# EAGLE design IRSensorController (EAGLE 9.4.2)
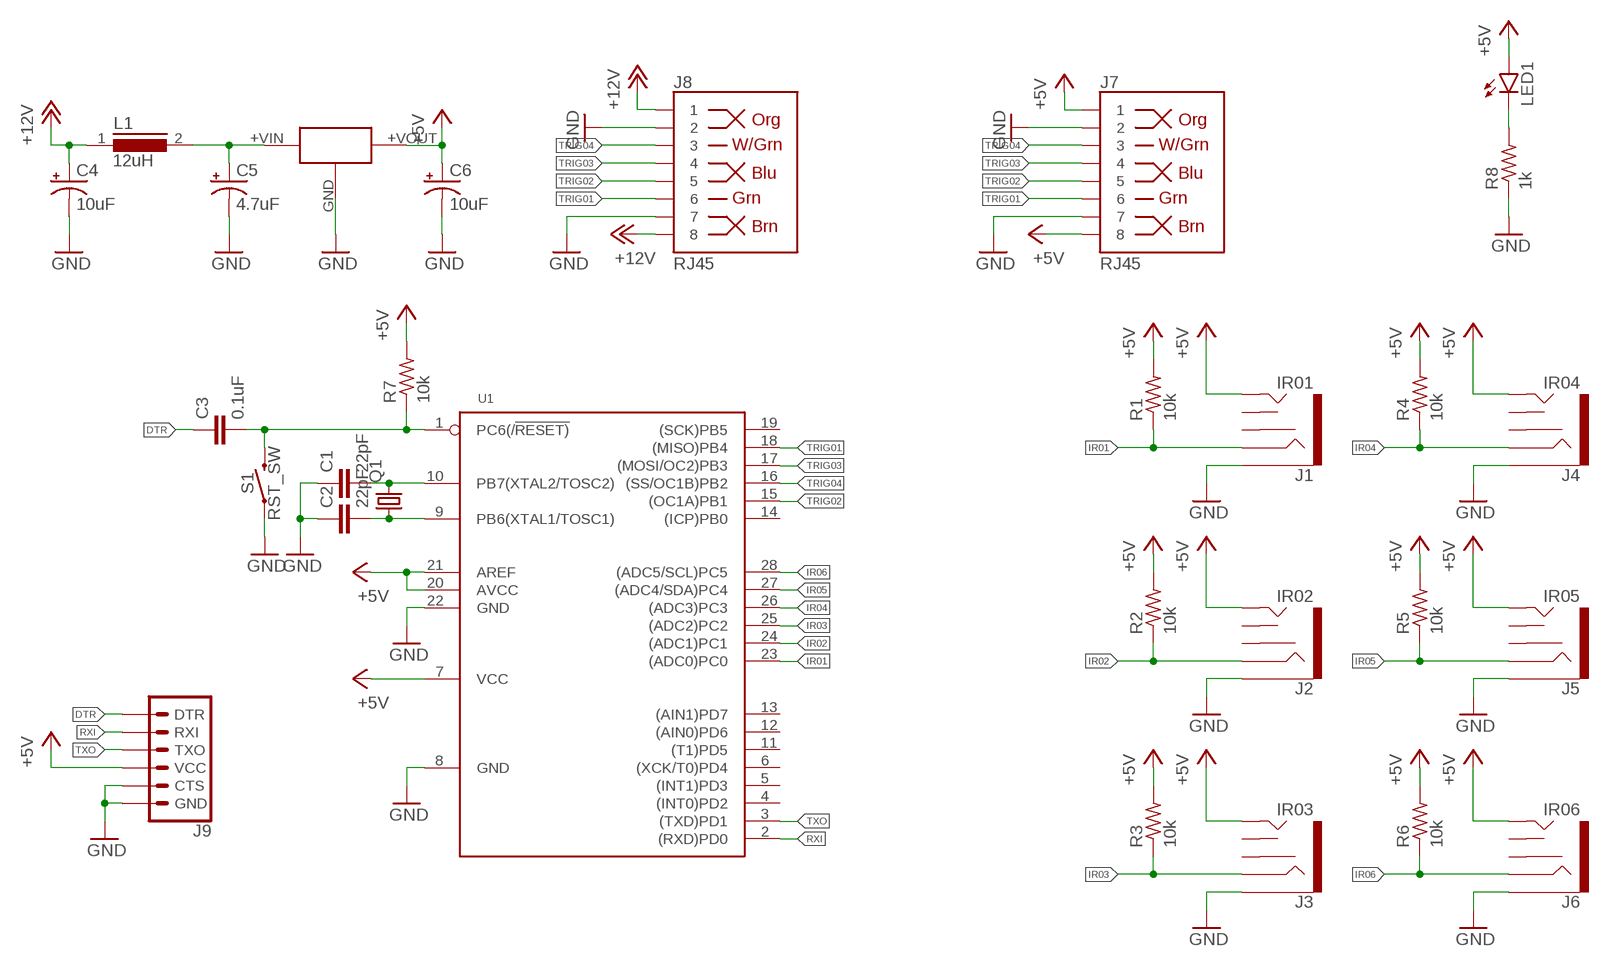
[diagram p0: schematic, sheet 1]

## Parts
C1  22pF  C-EU050-025X075  [C050-025X075]
C2  22pF  C-EU050-025X075  [C050-025X075]
C3  0.1uF  C-EU050-025X075  [C050-025X075]
C4  10uF  CPOL-USE3.5-8  [E3,5-8]
C5  4.7uF  CPOL-USE2.5-7  [E2,5-7]
C6  10uF  CPOL-USE3.5-8  [E3,5-8]
J1  IR01  AUDIO_JACK_3.5MM_KIT  [AUDIO-JACK-KIT]
J2  IR02  AUDIO_JACK_3.5MM_KIT  [AUDIO-JACK-KIT]
J3  IR03  AUDIO_JACK_3.5MM_KIT  [AUDIO-JACK-KIT]
J4  IR04  AUDIO_JACK_3.5MM_KIT  [AUDIO-JACK-KIT]
J5  IR05  AUDIO_JACK_3.5MM_KIT  [AUDIO-JACK-KIT]
J6  IR06  AUDIO_JACK_3.5MM_KIT  [AUDIO-JACK-KIT]
J7  RJ45  RJ45-8  [RJ45-8]
J8  RJ45  RJ45-8  [RJ45-8]
J9  6_PIN_SERIAL_TARGETSILK  [6_PIN_SERIAL_TARGET_SIDE_W_SILK]
L1  12uH  B82131  [SUKW1-17]
LED1  LED5MM  [LED5MM]
Q1  CRYSTALHC49S  [HC49/S]
R1  10k  R-US_0204/7  [0204/7]
R2  10k  R-US_0204/7  [0204/7]
R3  10k  R-US_0204/7  [0204/7]
R4  10k  R-US_0204/7  [0204/7]
R5  10k  R-US_0204/7  [0204/7]
R6  10k  R-US_0204/7  [0204/7]
R7  10k  R-US_0204/7  [0204/7]
R8  1k  R-US_0204/7  [0204/7]
S1  RST_SW  MOMENTARY-SWITCH-SPST-PTH-6.0MM  [TACTILE_SWITCH_PTH_6.0MM]
U1  MCU-ATMEGA328P-PU(DIP28)  [DIP28-2.54-34.7X7.62MM]
U$1  R_78E_5V  [R_78E]

## Nets
+5V: C6.+ J1.TIP J2.TIP J3.TIP J4.TIP J5.TIP J6.TIP J7.1 J7.8 J9.P$4(VCC) LED1.A R1.2 R2.2 R3.2 R4.2 R5.2 R6.2 R7.2 U1.7(VCC) U1.20(AVCC) U1.21(AREF) U$1.+VOUT
+12V: C4.+ J8.1 J8.8 L1.1
DTR: C3.1 J9.P$1(DTR)
GND: C1.1 C2.1 C4.- C5.- C6.- J1.SLEEVE J2.SLEEVE J3.SLEEVE J4.SLEEVE J5.SLEEVE J6.SLEEVE J7.2 J7.7 J8.2 J8.7 J9.P$5(CTS) J9.P$6(GND) R8.1 S1.1 U1.8(GND) U1.22(GND) U$1.GND
IR01: J1.RING R1.1 U1.23((ADC0)PC0)
IR02: J2.RING R2.1 U1.24((ADC1)PC1)
IR03: J3.RING R3.1 U1.25((ADC2)PC2)
IR04: J4.RING R4.1 U1.26((ADC3)PC3)
IR05: J5.RING R5.1 U1.27((ADC4/SDA)PC4)
IR06: J6.RING R6.1 U1.28((ADC5/SCL)PC5)
N$1: C5.+ L1.2 U$1.+VIN
N$2: LED1.K(C) R8.2
N$3: C2.2 Q1.1 U1.9(PB6(XTAL1/TOSC1))
N$4: C1.2 Q1.2 U1.10(PB7(XTAL2/TOSC2))
N$5: C3.2 R7.1 S1.3 U1.1(PC6(/!RESET))
RXI: J9.P$3(RXI) U1.2((RXD)PD0)
TRIG01: J7.6 J8.6 U1.18((MISO)PB4)
TRIG02: J7.5 J8.5 U1.15((OC1A)PB1)
TRIG03: J7.4 J8.4 U1.17((MOSI/OC2)PB3)
TRIG04: J7.3 J8.3 U1.16((SS/OC1B)PB2)
TXO: J9.P$2(TXO) U1.3((TXD)PD1)
Unconnected: J1.RSH J1.TSH J2.RSH J2.TSH J3.RSH J3.TSH J4.RSH J4.TSH J5.RSH J5.TSH J6.RSH J6.TSH U1.4((INT0)PD2) U1.5((INT1)PD3) U1.6((XCK/T0)PD4) U1.11((T1)PD5) U1.12((AIN0)PD6) U1.13((AIN1)PD7) U1.14((ICP)PB0) U1.19((SCK)PB5)

## Library data of the parts
C1-C3 = rcl:C-EU: CAPACITOR, European symbol; SPICEPREFIX: C
C4-C6 = rcl:CPOL-US: POLARIZED CAPACITOR, American symbol; SPICEPREFIX: C
J1-J6 = SparkFun-Connectors:AUDIO_JACK_3.5MM: Audio Jack 3.5mm variants of PTH and SMT stereo audio jack with bypass switches. SparkFun Products: SparkFun SparkPunk Sound Kit <[https://www.sparkfun.com/products/11177]> - PTH MP3 Trigger <https://www.sparkfun.com/products/13720> -3.5mm SMD SparkFun PicoBoard <https://www.sparkfun.com/products/11888>- 2.5mm SMD; PROD_ID: CONN-08774; SF_ID: PRT-08032
J7 J8 = SparkFun-Connectors:RJ45-8: RJ45 Jack - 8 pin Simple RJ45, 8-pin connection. Commonly used for Cat5, Cat5e, and Cat6 Ethernet cables. Here is the connector we sell at SparkFun: RJ45 8-Pin Connector <https://www.sparkfun.com/products/643> (PRT-00643) Datasheet <https://cdn.sparkfun.com/datasheets/Prototyping/04908.pdf> It is used on this SparkFun product: SparkFun RJ45 Breakout <https://www.sparkfun.com/products/716> (BOB-00716) Note, you may also be interested in the "MAGJACK" version of this. It is basically a RJ45 connector, but also has some status LEDs built into the connector housing. You can check that out in this library at the device named "MAGJACK.dev" and see these products online: RJ45 Ethernet MagJack-Compatible <https://www.sparkfun.com/products/8534> (PRT-08534) SparkFun RJ45 MagJack Breakout <https://www.sparkfun.com/products/13021> (BOB-13021); PROD_ID: CONN-08506; SF_ID: PRT-00643
J9 = SparkFun-Connectors:6_PIN_SERIAL_TARGET: 6-pin header connection for use with the "FTDI BASIC" pinout - TARGET SIDE. Also known as "Arduino Serial Program Header". It is used to mate with our FTDI Basic serial programmers using the Arduino IDE. Note, this device has "TARGET" in the name. It is intended to be used on a design that contains a target micro-controller that you wish to program. The "sister" device, named "CABLE" is inteneded to be used on a design that usually lives on the end of your USB cable and prvides the converter chip (FTDI232 or FTDI231x) to commnicate serial RX/TX. You can populate with some of these: Break Away Headers - Straight <https://www.sparkfun.com/products/116> (PRT-00116) For reference (or to suit your programming needs) check out these designs: SparkFun FTDI Basic Breakout - 5V <https://www.sparkfun.com/products/9716> (DEV-09716) SparkFun FTDI Basic Breakout - 3.3V <https://www.sparkfun.com/products/9873> (DEV-09873) SparkFun FTDI SmartBasic <https://www.sparkfun.com/products/12935> (DEV-12935) SparkFun Beefy 3 - FTDI Basic Breakout <https://www.sparkfun.com/products/13746> (DEV-13746)
L1 = inductors:B82131: INDUCTOR; SPICEPREFIX: L
LED1 = led:LED: LED OSRAM: - CHIPLED LG R971, LG N971, LY N971, LG Q971, LY Q971, LO R971, LY R971 LH N974, LH R974 LS Q976, LO Q976, LY Q976 LO Q996 - Hyper CHIPLED LW Q18S LB Q993, LB Q99A, LB R99A - SideLED LS A670, LO A670, LY A670, LG A670, LP A670 LB A673, LV A673, LT A673, LW A673 LH A674 LY A675 LS A676, LA A676, LO A676, LY A676, LW A676 LS A679, LY A679, LG A679 - Hyper Micro SIDELED® LS Y876, LA Y876, LO Y876, LY Y876 LT Y87S - SmartLED LW L88C, LW L88S LB L89C, LB L89S, LG L890 LS L89K, LO L89K, LY L89K LS L896, LA L896, LO L896, LY L896 - TOPLED LS T670, LO T670, LY T670, LG T670, LP T670 LSG T670, LSP T670, LSY T670, LOP T670, LYG T670 LG T671, LOG T671, LSG T671 LB T673, LV T673, LT T673, LW T673 LH T674 LS T676, LA T676, LO T676, LY T676, LB T676, LH T676, LSB T676, LW T676 LB T67C, LV T67C, LT T67C, LS T67K, LO T67K, LY T67K, LW E67C LS E67B, LA E67B, LO E67B, LY E67B, LB E67C, LV E67C, LT E67C LW T67C LS T679, LY T679, LG T679 LS T770, LO T770, LY T770, LG T770, LP T770 LB T773, LV T773, LT T773, LW T773 LH T774 LS E675, LA E675, LY E675, LS T675 LS T776, LA T776, LO T776, LY T776, LB T776 LHGB T686 LT T68C, LB T68C - Hyper Mini TOPLED® LB M676 - Mini TOPLED Santana® LG M470 LS M47K, LO M47K, LY M47K Source: http://www.osram.convergy.de LUXEON: - LUMILED® LXK2-PW12-R00, LXK2-PW12-S00, LXK2-PW14-U00, LXK2-PW14-V00 LXK2-PM12-R00, LXK2-PM12-S00, LXK2-PM14-U00 LXK2-PE12-Q00, LXK2-PE12-R00, LXK2-PE12-S00, LXK2-PE14-T00, LXK2-PE14-U00 LXK2-PB12-K00, LXK2-PB12-L00, LXK2-PB12-M00, LXK2-PB14-N00, LXK2-PB14-P00, LXK2-PB14-Q00 LXK2-PR12-L00, LXK2-PR12-M00, LXK2-PR14-Q00, LXK2-PR14-R00 LXK2-PD12-Q00, LXK2-PD12-R00, LXK2-PD12-S00 LXK2-PH12-R00, LXK2-PH12-S00 LXK2-PL12-P00, LXK2-PL12-Q00, LXK2-PL12-R00 Source: www.luxeon.com KINGBRIGHT: KA-3528ASYC Source: www.kingbright.com
Q1 = adafruit:CRYSTAL: CRYSTAL; OC_FARNELL: 1667008; OC_NEWARK: unknown
R1-R8 = rcl:R-US_: RESISTOR, American symbol; SPICEPREFIX: R
S1 = SparkFun-Switches:MOMENTARY-SWITCH-SPST: Momentary Switch (Pushbutton) - SPST Normally-open (NO) SPST momentary switches (buttons, pushbuttons). Variants PTH-12MM - 12mm square, through-hole Momentary Pushbutton Switch - 12mm Square <https://www.sparkfun.com/products/9190> (COM-09190) PTH-6.0MM, PTH-6.0MM-KIT - 6.0mm square, through-hole Mini Pushbutton Switch <https://www.sparkfun.com/products/97> (COM-00097) KIT package intended for soldering kit's - only one side of pads' copper is exposed. PTH-RIGHT-ANGLE-KIT - Right-angle, through-hole Right Angle Tactile Button <https://www.sparkfun.com/products/10791> - Used on SparkFun BigTime Watch Kit <https://www.sparkfun.com/products/11734> SMD-12MM - 12mm square, surface-mount Tactile Button - SMD (12mm) <https://www.sparkfun.com/products/12993> (COM-12993) Used on SparkFun PicoBoard <https://www.sparkfun.com/products/11888> SMD-4.5MM - 4.5mm Square Trackball Switch Used on SparkFun Blackberry Trackballer Breakout <https://www.sparkfun.com/products/13169> SMD-4.6MMX2.8MM - 4.60mm x 2.80mm, surface mount Used on SparkFun SAMD21 Mini Breakout <https://www.sparkfun.com/products/13664> SMD-5.2MM, SMD-5.2-REDUNDANT - 5.2mm square, surface-mount Mini Pushbutton Switch - SMD <https://www.sparkfun.com/products/8720> (COM-08720) Used on Arduino Pro Mini <https://www.sparkfun.com/products/11114> REDUNDANT package connects both switch circuits together SMD-6.0X3.5MM - 6.0 x 3.5mm, surface mount Momentary Reset Switch SMD <https://www.sparkfun.com/products/8229> (COM-08229) SMD-6.2MM-TALL - 6.2mm square, surface mount Tactile Button - SMD (6mm) <https://www.sparkfun.com/products/12992> Used on SparkFun Digital Sandbox <https://www.sparkfun.com/products/12651> SMD-RIGHT-ANGLE - Right-angle, surface mount Used on SparkFun Block for Intel® Edison - Arduino <https://www.sparkfun.com/products/13036>; PROD_ID: SWCH-08441; SF_SKU: COM-00097
U1 = Seeed-IC:MCU-ATMEGA328P-PU(DIP28): 310010051; MPN: ATMEGA328P-PU
U$1 = EzerLonginus:R_78E_5V

## Board
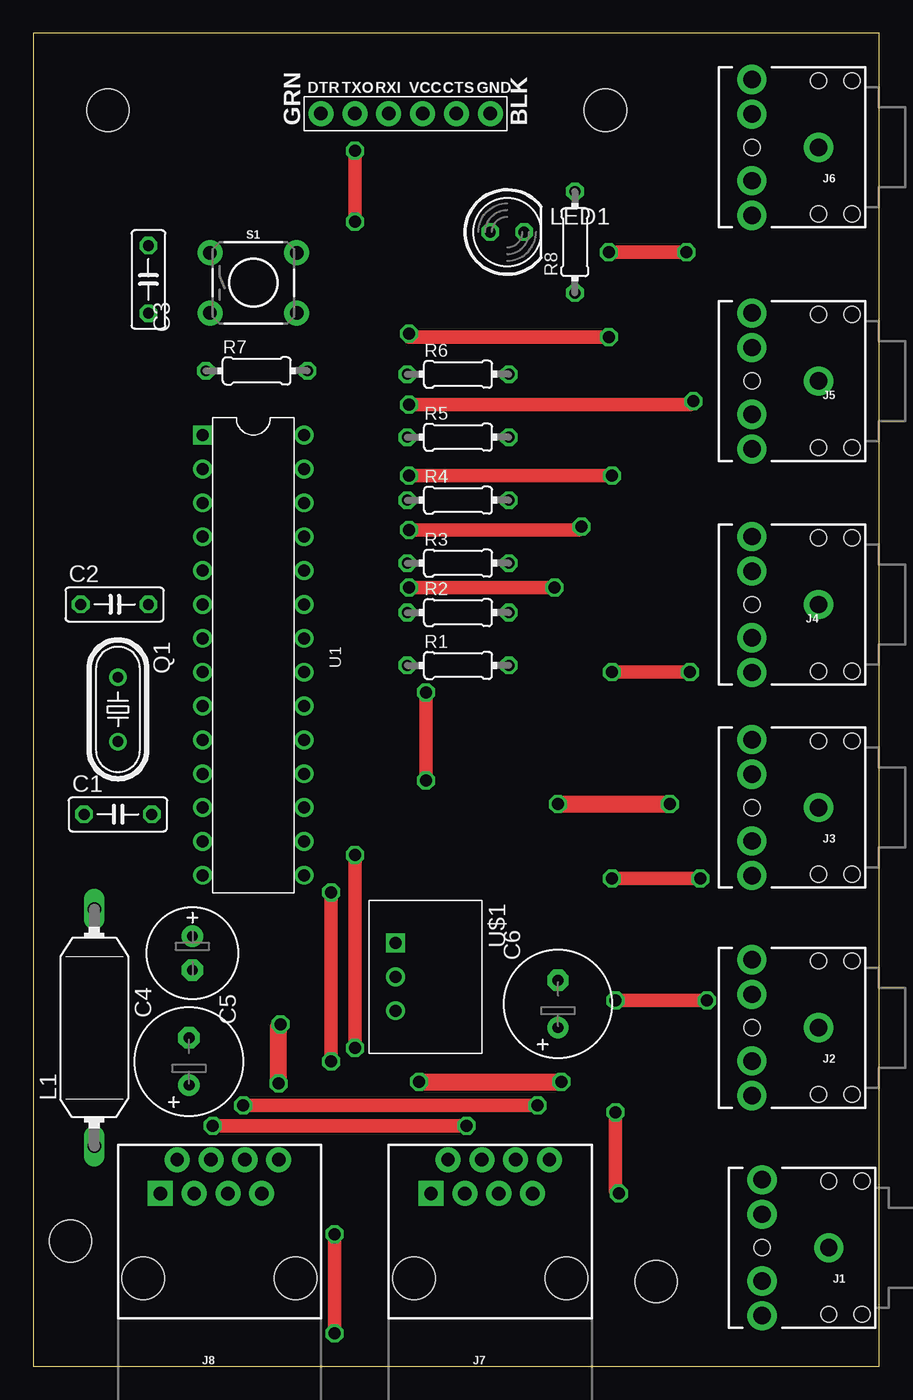
[diagram p1: board, top side]
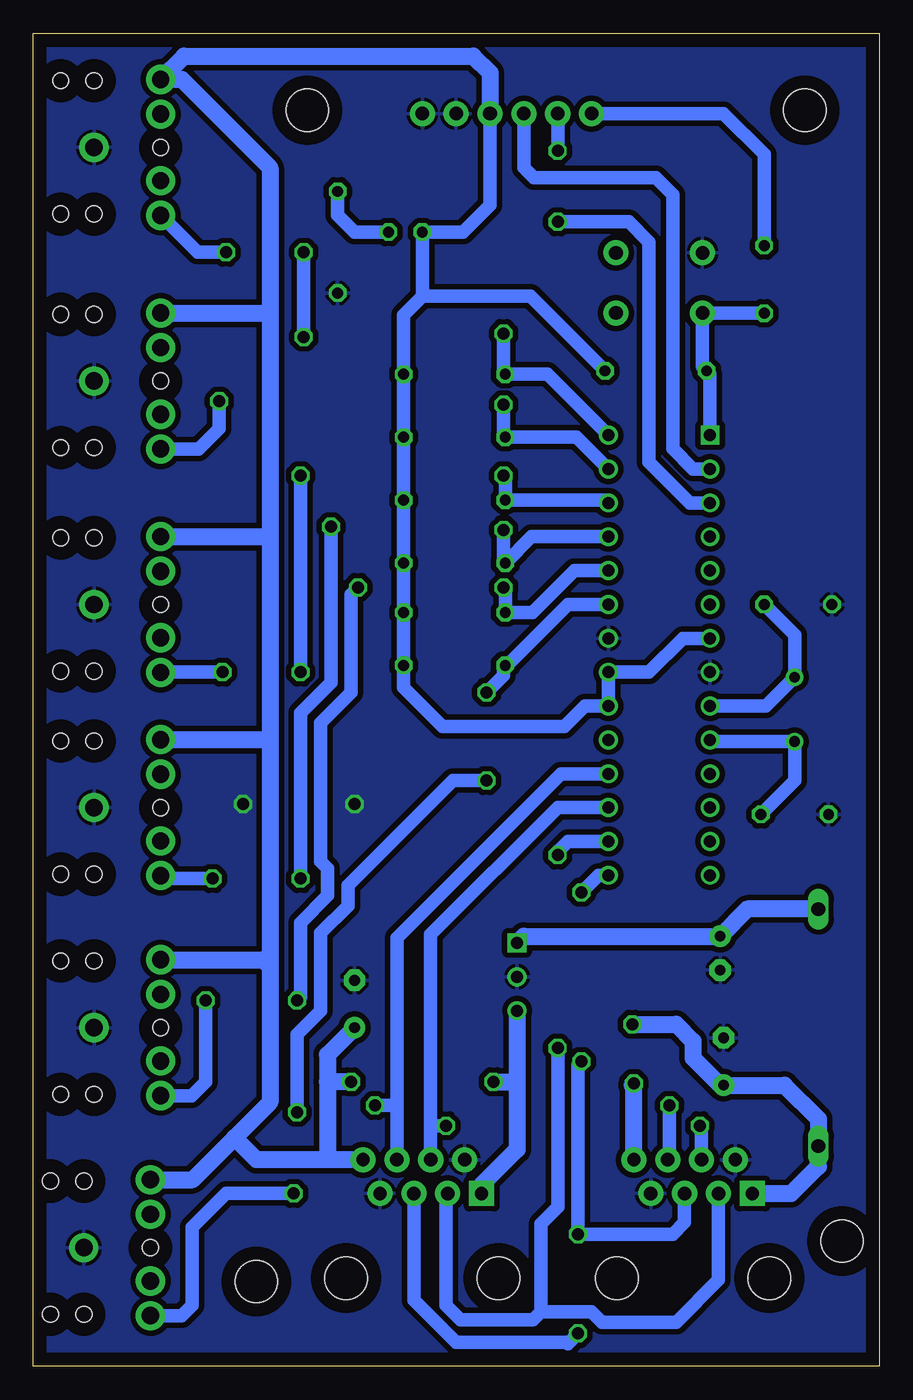
[diagram p2: board, bottom side, seen from below]

Size 63.48 x 100 mm. Coordinates in mm from the lower left corner, seen from the top.
Outline: 0,0 63.48,0 63.48,100 0,100 0,0
Copper layers (1*16): Top 0.035mm / dielectric 1.5mm / Bottom 0.035mm
Design rules "default": minimum track width 6mil, minimum drill 0.35mm, track to track 6mil, track to pad 6mil, pad to pad 6mil, via to via 6mil, smd to smd 6mil, copper to edge 40mil, drill to drill 6mil, minimum pad ring 10mil, minimum via ring 8mil, stop-mask expansion 4mil, vias tented up to drill 0mil, thermal gap 10mil
Holes 3.17 mm at 5.59,94.23 42.93,94.23 46.74,6.35 2.79,9.4

### Footprints (pad centres in the part's own frame; a part is rotated, then mirrored left to right if it is on the bottom)
C050-025X075 = drill 0.813 octagon: 1 -2.54,0; 2 2.54,0
E3,5-8 = drill 0.813 pad 1.6: + -1.778,0 | drill 0.813 pad 1.6 octagon: - 1.778,0
E2,5-7 = drill 0.813 pad 1.6: + -1.27,0 | drill 0.813 pad 1.6 octagon: - 1.27,0
AUDIO-JACK-KIT = drill 1.3 pad 2.184: RING 5,5.1; RSH 5,2.5; SLEEVE 0,0; TIP 5,-5.1; TSH 5,-2.5 | hole 1.2: 0,5; -2.5,5; -2.5,-5; 0,-5; 5,0
RJ45-8 = drill 1 pad 1.88 square: 1 -4.445,6.35 | drill 1 pad 1.88: 2 -3.175,8.89; 3 -1.905,6.35; 4 -0.635,8.89; 5 0.635,6.35; 6 1.905,8.89; 7 3.175,6.35; 8 4.445,8.89 | hole 3.2: -5.715,0; 5.715,0
6_PIN_SERIAL_TARGET_SIDE_W_SILK = drill 1.016 pad 1.88: P$1 -6.35,0; P$2 -3.81,0; P$3 -1.27,0; P$4 1.27,0; P$5 3.81,0; P$6 6.35,0
SUKW1-17 = drill 1.016 long: 1 -8.89,0; 2 8.89,0
LED5MM = drill 0.813 octagon: A -1.27,0; K 1.27,0
HC49/S = drill 0.813: 1 -2.413,0; 2 2.413,0
0204/7 = drill 0.813 octagon: 1 -3.81,0; 2 3.81,0
TACTILE_SWITCH_PTH_6.0MM = drill 1.016 pad 1.88: 1 -3.251,2.261; 2 3.251,2.261; 3 -3.251,-2.261; 4 3.251,-2.261
DIP28-2.54-34.7X7.62MM = drill 0.9 pad 1.4 square: 1 -16.51,-3.81 | drill 0.9 pad 1.4: 2 -13.97,-3.81; 3 -11.43,-3.81; 4 -8.89,-3.81; 5 -6.35,-3.81; 6 -3.81,-3.81; 7 -1.27,-3.81; 8 1.27,-3.81; 9 3.81,-3.81; 10 6.35,-3.81; 11 8.89,-3.81; 12 11.43,-3.81; 13 13.97,-3.81; 14 16.51,-3.81; 15 16.51,3.81; 16 13.97,3.81; 17 11.43,3.81; 18 8.89,3.81; 19 6.35,3.81; 20 3.81,3.81; 21 1.27,3.81; 22 -1.27,3.81; 23 -3.81,3.81; 24 -6.35,3.81; 25 -8.89,3.81; 26 -11.43,3.81; 27 -13.97,3.81; 28 -16.51,3.81
R_78E = drill 0.9 square: +VIN -2.54,0 | drill 0.9: +VOUT 2.54,0; GND 0,0

### Placement (x,y rotation side)
C1  6.35,41.4 0 top
C2  6.1,57.15 0 top
C3  8.64,81.53 270 top
C4  11.68,22.86 90 top
C5  11.94,30.99 270 top
C6  39.37,27.18 90 top
J1  59.69,8.89 180 top
J2  58.93,25.4 180 top
J3  58.93,41.91 180 top
J4  58.93,57.15 180 top
J5  58.93,73.91 180 top
J6  58.93,91.44 180 top
J7  34.29,6.6 0 top
J8  13.97,6.6 0 top
J9  27.94,93.98 0 top
L1  4.57,25.4 90 top
LED1  35.56,85.09 0 top
Q1  6.35,49.28 270 top
R1  31.88,52.58 0 top
R2  31.88,56.54 0 top
R3  31.88,60.25 0 top
R4  31.88,64.97 0 top
R5  31.88,69.7 0 top
R6  31.88,74.42 0 top
R7  16.76,74.68 0 top
R8  40.64,84.33 90 top
S1  16.51,81.28 0 top
U1  16.51,53.34 270 top
U$1  27.18,29.21 270 top

### Tracks (layer width: path | path; a pad name or v marks a point on that pad's centre or on a via)
+5V  (via drill 0.9)
  Top 1.27: v28.96,21.34 v39.62,21.34
  Bottom 1.016: U1.7 14.73,54.61 17.27,52.07 U1.21 U1.20 22.1,49.53 23.62,48.01 32.77,48.01 35.69,50.93 R1.2 R2.2 R3.2 R4.2 R5.2 R6.2 35.69,78.87 34.29,80.26 | 34.29,80.26 LED1.A 31.24,85.09 29.21,87.12 J9.P$4 | R7.2 26.16,80.26 34.29,80.26
  Bottom 1.27: U$1.+VOUT 27.18,21.34 | 27.18,21.34 27.18,16.26 29.84,13.59 J7.1 | 39.5,25.27 C6.+ 41.4,23.37 41.4,21.34 | 45.72,79.01 45.72,89.92 52.34,96.54 J6.TIP 52.17,98.3 30.48,98.3 29.21,97.03 J9.P$4 | 45.72,79.01 45.72,61.98 | 45.72,61.98 45.72,46.99 | 45.72,46.99 45.72,29.97 | 45.72,29.97 45.72,19.81 48.39,17.14 | J1.TIP 51.54,13.99 48.39,17.14 | J5.TIP 45.72,79.01 | J2.TIP 46.25,30.5 45.72,29.97 | J4.TIP 45.99,62.25 45.72,61.98 | J3.TIP 45.74,47.01 45.72,46.99 | J7.8 41.4,15.49 | 41.4,15.49 46.74,15.49 48.39,17.14 | 41.4,21.34 41.4,15.49 | v28.96,21.34 27.18,21.34 | v39.62,21.34 41.4,21.34
+12V  (via drill 0.9)
  Top 1.27: v18.41,21.21 18.41,25.53 v18.54,25.65
  Bottom 1.27: J8.8 18.41,20.95 18.54,21.08 v18.41,21.21 | v18.54,25.65 15.24,25.65 13.97,24.38 13.97,23.11 11.94,21.08 C4.+ 7.11,21.08 4.57,18.54 L1.1 4.57,14.99 6.6,12.95 J8.1
DTR
  Bottom 1.016: J9.P$1 11.68,93.98 8.64,90.93 C3.1
GND  (via drill 0.9)
  Top 1.27: v39.37,42.16 v47.75,42.16
  pour Bottom (isolate 0.406): 0,100.33 63.5,100.33 63.5,0 0,0
IR01  (via drill 0.9)
  Top 1.016: v43.94,12.95 43.69,13.21 v43.69,19.05 | v29.46,50.55 v29.46,43.94
  Bottom 1.016: U1.23 23.37,57.15 27.94,52.58 R1.1 28.19,52.45 28.19,51.82 v29.46,50.55 | J1.RING 52.34,3.79 51.56,4.57 51.56,10.41 49.02,12.95 v43.94,12.95 | v43.69,19.05 43.69,24.89 41.91,26.67 41.91,32.51 39.88,34.54 39.88,36.07 32,43.94 v29.46,43.94
IR02  (via drill 0.9)
  Top 1.016: v50.55,27.43 v43.69,27.43 | v39.12,58.42 v28.19,58.42
  Bottom 1.016: U1.24 22.89,59.69 26.04,56.54 R2.1 28.07,58.29 v28.19,58.42 | J2.RING 51.58,20.3 50.55,21.34 v50.55,27.43 | v43.69,27.43 43.43,27.69 43.43,33.27 41.4,35.31 41.4,37.34 41.92,37.85 41.92,48.25 | 41.92,48.25 39.62,50.55 39.62,57.91 v39.12,58.42 | 41.92,48.25
IR03  (via drill 0.9)
  Top 1.016: v50.04,36.58 v43.43,36.58 | v41.15,62.99 40.89,62.74 v28.19,62.74
  Bottom 1.016: U1.25 26.09,62.23 R3.1 28.19,60.38 v28.19,62.74 | J3.RING 53.69,36.58 v50.04,36.58 | v43.43,36.58 43.43,49.02 41.15,51.31 v41.15,62.99
IR04  (via drill 0.9)
  Top 1.016: v28.19,66.8 v43.43,66.8 | v43.43,52.07 v49.28,52.07
  Bottom 1.016: U1.26 20.52,64.97 R4.1 28.07,66.42 28.19,66.55 v28.19,66.8 | v43.43,66.8 v43.43,52.07 | v49.28,52.07 53.91,52.07 J4.RING
IR05  (via drill 0.9)
  Top 1.016: v49.53,72.39 49.28,72.14 v28.19,72.14
  Bottom 1.016: U1.27 22.71,69.7 R5.1 28.19,69.83 v28.19,72.14 | J5.RING 51.07,68.81 49.53,70.36 v49.53,72.39
IR06  (via drill 0.9)
  Top 1.016: v43.18,77.22 28.19,77.22 v28.19,77.47 | v49.02,83.57 v43.18,83.57
  Bottom 1.016: U1.28 24.89,74.42 R6.1 28.19,74.55 v28.19,77.47 | J6.RING 51.15,83.57 v49.02,83.57 | v43.18,83.57 v43.18,77.22
N$1
  Bottom 1.27: L1.2 9.91,34.29 C5.+ 26.67,32.26 U$1.+VIN
N$2
  Bottom 1.016: LED1.K 39.37,85.09 40.64,86.36 R8.2
N$3
  Bottom 1.016: U1.9 8.51,49.53 Q1.1 6.35,54.86 C2.2
N$4
  Bottom 1.016: U1.10 12.57,46.86 Q1.2 6.35,43.94 C1.2
N$5
  Bottom 1.016: U1.1 12.7,74.42 R7.1 13.26,74.98 S1.3 8.66,79.02 C3.2
RXI
  Bottom 1.016: U1.2 13.97,67.31 15.49,68.83 15.49,87.88 16.76,89.15 25.91,89.15 26.67,89.92 J9.P$3
TRIG01  (via drill 0.9)
  Top 1.016: v37.85,19.56 v15.75,19.56
  Bottom 1.016: J7.6 36.2,19.56 | 36.2,19.56 36.2,32.13 30.99,37.34 30.48,37.85 23.88,44.45 U1.18 | J8.6 15.75,15.62 v15.75,19.56 | v37.85,19.56 36.2,19.56
TRIG02  (via drill 0.9)
  Top 1.016: v22.61,9.91 v22.61,2.45 | v22.35,22.86 v22.35,35.56
  Bottom 1.016: J8.5 14.61,10.79 15.49,9.91 v22.61,9.91 22.61,22.61 v22.35,22.86 | J7.5 34.92,4.95 31.75,1.78 23.37,1.78 23.37,1.69 v22.61,2.45 | v22.35,35.56 21.08,36.83 U1.15
TRIG03  (via drill 0.9)
  Top 1.016: v13.46,18.03 v32.51,18.03
  Bottom 1.016: J7.4 33.66,18.03 | 33.66,18.03 33.66,32.38 24.13,41.91 U1.17 | J8.4 13.34,17.91 v13.46,18.03 | v32.51,18.03 33.66,18.03
TRIG04  (via drill 0.9)
  Top 1.016: v24.13,38.35 v24.13,23.88
  Bottom 1.016: J8.3 12.06,6.48 15.24,3.3 20.83,3.3 21.59,4.06 25.4,4.06 | J7.3 32.51,12.83 32.51,4.57 31.42,3.48 25.98,3.48 25.4,4.06 | 25.4,4.06 25.4,10.67 24.13,11.94 v24.13,23.88 | U1.16 23.37,39.37 24.13,38.61 v24.13,38.35
TXO  (via drill 0.9)
  Top 1.016: v24.13,91.19 v24.13,85.85
  Bottom 1.016: J9.P$2 v24.13,91.19 | U1.3 14.22,64.77 17.27,67.82 17.27,84.33 18.8,85.85 v24.13,85.85